# EAGLE schematic power-supply (EAGLE 9.1.1)
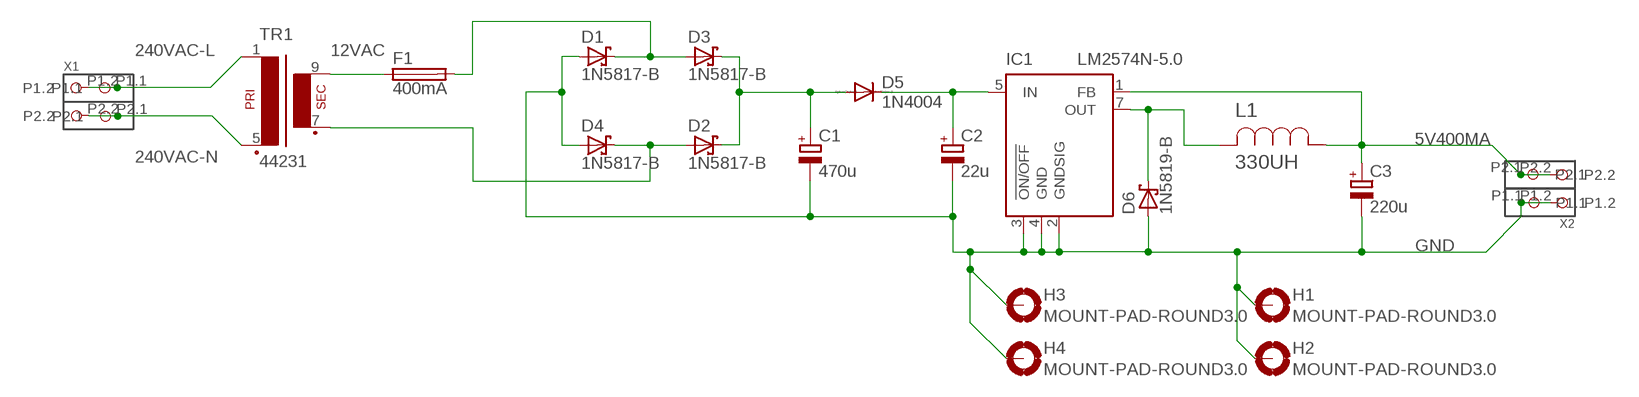
[diagram p0: schematic, sheet 1]

## Parts
C1  470u  CPOL-EUE3.5-8  [E3,5-8]
C2  22u  CPOL-EUE2-4  [E2-4]
C3  220u  CPOL-EUE2-5  [E2-5]
D1  1N5817-B  [DO41-7.6]
D2  1N5817-B  [DO41-7.6]
D3  1N5817-B  [DO41-7.6]
D4  1N5817-B  [DO41-7.6]
D5  1N4004  [DO41-10]
D6  1N5819-B  [DO41-7.6]
F1  400mA  SH22,5  [SH22,5]
H1  MOUNT-PAD-ROUND3.0  [3,0-PAD]
H2  MOUNT-PAD-ROUND3.0  [3,0-PAD]
H3  MOUNT-PAD-ROUND3.0  [3,0-PAD]
H4  MOUNT-PAD-ROUND3.0  [3,0-PAD]
IC1  LM2574N-5.0  [DIL08]
L1  330UH  ELC11D331F-11D  [IND_ELC11D]
TR1  44231  EI42-1  [EI42-1]
X1  2604-1102  [P-2604-1102]
X2  2604-1102  [P-2604-1102]

## Nets
5V400MA: C3.+ IC1.1(FB) L1.1 X2.P2.1 X2.P2.2
12VAC: F1.1 TR1.9(S4)
240VAC-L [240V]: TR1.1 X1.P1.1 X1.P1.2
240VAC-N [240V]: TR1.5(P2) X1.P2.1 X1.P2.2
GND: C1.- C2.- C3.- D1.A D4.A D6.A H1.B3,0(MOUNT) H2.B3,0(MOUNT) H3.B3,0(MOUNT) H4.B3,0(MOUNT) IC1.2(GNDSIG) IC1.3(!ON/OFF) IC1.4(GND) X2.P1.1 X2.P1.2
N$1: C2.+ D5.C IC1.5(IN)
N$3: C1.+ D2.C D3.C D5.A
N$4: D1.C D3.A F1.2
N$5: D2.A D4.C TR1.7(S3)
N$6: D6.C IC1.7(OUT) L1.2

## Library data of the parts
C1-C3 = rcl:CPOL-EU: POLARIZED CAPACITOR, European symbol; SPICEPREFIX: C
D1-D4 D6 = diode:1N581*: 1.0A SCHOTTKY BARRIER RECTIFIER Source: http://www.diodes.com/datasheets/ds23001.pdf
D5 = diode:1N4004: DIODE general purpose rectifier, 1 A
F1 = fuse:SH22,5: FUSE HOLDER grid 22,5 mm, OGN0031 8201, Schurter (Buerklin); MF: SCHURTER; MPN: 0031.8201; OC_FARNELL: 1162740; OC_NEWARK: 96F8317
H1-H4 = holes:MOUNT-PAD-ROUND: MOUNTING PAD, round
IC1 = linear:LM2574?-*: SIMPLE SWITCHER 0.5A Step-Down Voltage Regulator Source: http://cache.national.com/ds/LM/LM2574.pdf
L1 = Panasonic-ELC:ELC: Choke Coils; CURRENTRATING: 1.0A; MPN: ELC11D331F; OC_FARNELL: 1308463; OC_NEWARK: unknown; PACKAGE: Radial Lead-TH; SUPPLIER: PANASONIC
TR1 = trafo:EI42-1: TRANSFORMER 1 primary winding, 1 secondary winding ERA
X1 X2 = con-wago_2604:2604-1102

## Net classes
0 default: width 0.254 mm, clearance 0.254 mm
1 240V: width 1.143 mm, clearance 0.762 mm